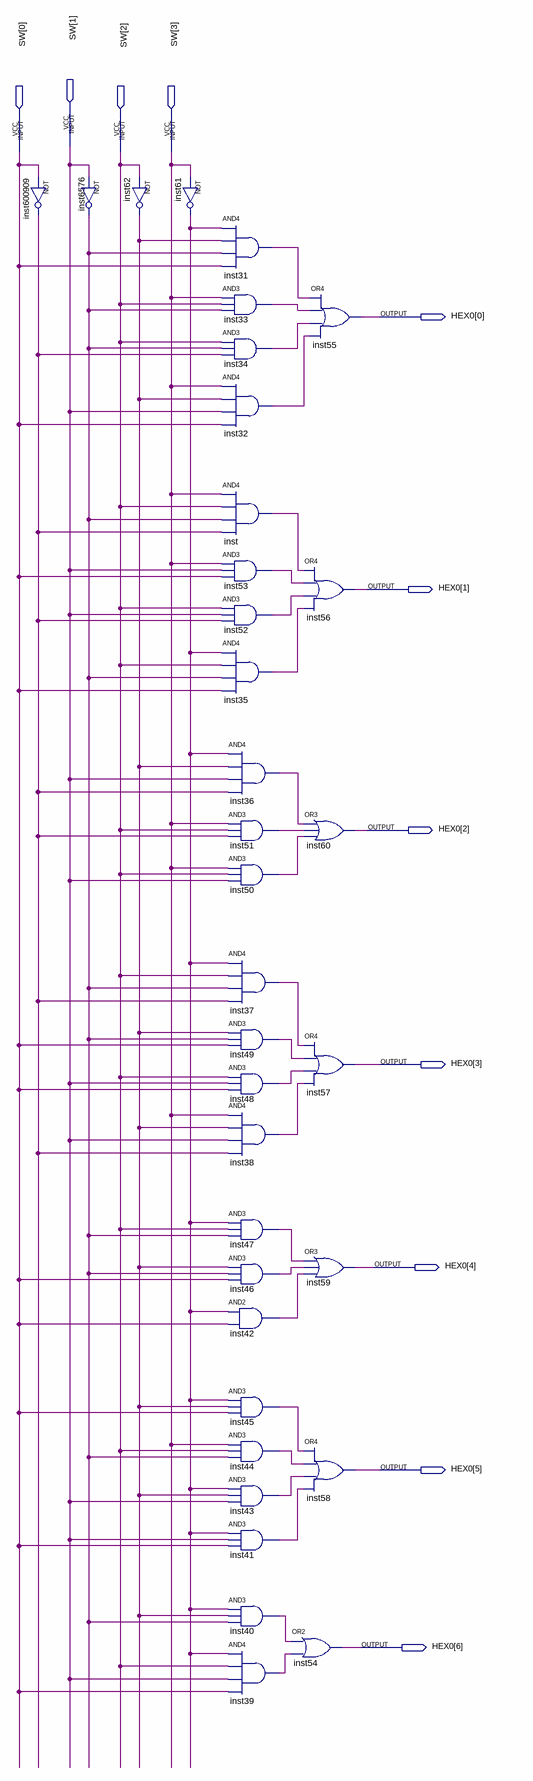
[diagram p0: schematic sheet]
// Quartus schematic lab03_ronnyismael.bdf as structural Verilog: 35 symbols, 11 pins
module lab03_ronnyismael (
  input  [3:0] SW,
  output [6:0] HEX0
);

  wire inst31_out, inst32_out, inst33_out, inst34_out, inst35_out, inst36_out, inst37_out, inst38_out,
       inst39_out, inst40_out, inst41_out, inst42_out, inst43_out, inst44_out, inst45_out, inst46_out,
       inst47_out, inst48_out, inst49_out, inst50_out, inst51_out, inst52_out, inst53_out, inst61_out,
       inst62_out, inst6576_out, inst600909_out, inst_out;

  not inst600909 (inst600909_out, SW[0]);
  not inst6576 (inst6576_out, SW[1]);
  not inst62 (inst62_out, SW[2]);
  not inst61 (inst61_out, SW[3]);
  and inst31 (inst31_out, inst61_out, inst62_out, inst6576_out, SW[0]);
  and inst33 (inst33_out, SW[3], SW[2], inst6576_out);
  and inst34 (inst34_out, SW[2], inst6576_out, inst600909_out);
  and inst32 (inst32_out, SW[3], inst62_out, SW[1], SW[0]);
  and inst (inst_out, SW[3], SW[2], inst6576_out, inst600909_out);
  and inst53 (inst53_out, SW[3], SW[1], SW[0]);
  and inst52 (inst52_out, SW[2], SW[1], inst600909_out);
  and inst35 (inst35_out, inst61_out, SW[2], inst6576_out, SW[0]);
  and inst36 (inst36_out, inst61_out, inst62_out, SW[1], inst600909_out);
  and inst51 (inst51_out, SW[3], SW[2], inst600909_out);
  and inst50 (inst50_out, SW[3], SW[2], SW[1]);
  and inst37 (inst37_out, inst61_out, SW[2], inst6576_out, inst600909_out);
  and inst49 (inst49_out, inst62_out, inst6576_out, SW[0]);
  and inst48 (inst48_out, SW[2], SW[1], SW[0]);
  and inst38 (inst38_out, SW[3], inst62_out, SW[1], inst600909_out);
  and inst47 (inst47_out, inst61_out, SW[2], inst6576_out);
  and inst46 (inst46_out, inst62_out, inst6576_out, SW[0]);
  and inst42 (inst42_out, inst61_out, SW[0]);
  and inst45 (inst45_out, inst61_out, inst62_out, SW[0]);
  and inst44 (inst44_out, SW[3], SW[2], inst6576_out);
  and inst43 (inst43_out, inst61_out, inst62_out, SW[1]);
  and inst41 (inst41_out, inst61_out, SW[1], SW[0]);
  and inst40 (inst40_out, inst61_out, inst62_out, inst6576_out);
  and inst39 (inst39_out, inst61_out, SW[2], SW[1], SW[0]);
  or inst55 (HEX0[0], inst31_out, inst33_out, inst34_out, inst32_out);
  or inst56 (HEX0[1], inst_out, inst53_out, inst52_out, inst35_out);
  or inst60 (HEX0[2], inst36_out, inst51_out, inst50_out);
  or inst57 (HEX0[3], inst37_out, inst49_out, inst48_out, inst38_out);
  or inst59 (HEX0[4], inst47_out, inst46_out, inst42_out);
  or inst58 (HEX0[5], inst45_out, inst44_out, inst43_out, inst41_out);
  or inst54 (HEX0[6], inst40_out, inst39_out);
endmodule
